# Altium schematic sheet Motion_sensor.SchDoc: Motion Sensor
size A4; Date: 9/24/2014; Author: P.A.; CompanyName: STMicroelectronics; Address1: 12, Rue Jules HOROWITZ; Address2: 38019 Grenoble; Address3: FRANCE; DocumentNumber: MB1189; Revision: A-01; SheetNumber: 13; SheetTotal: 13; Project: STM32F469I-DISCO
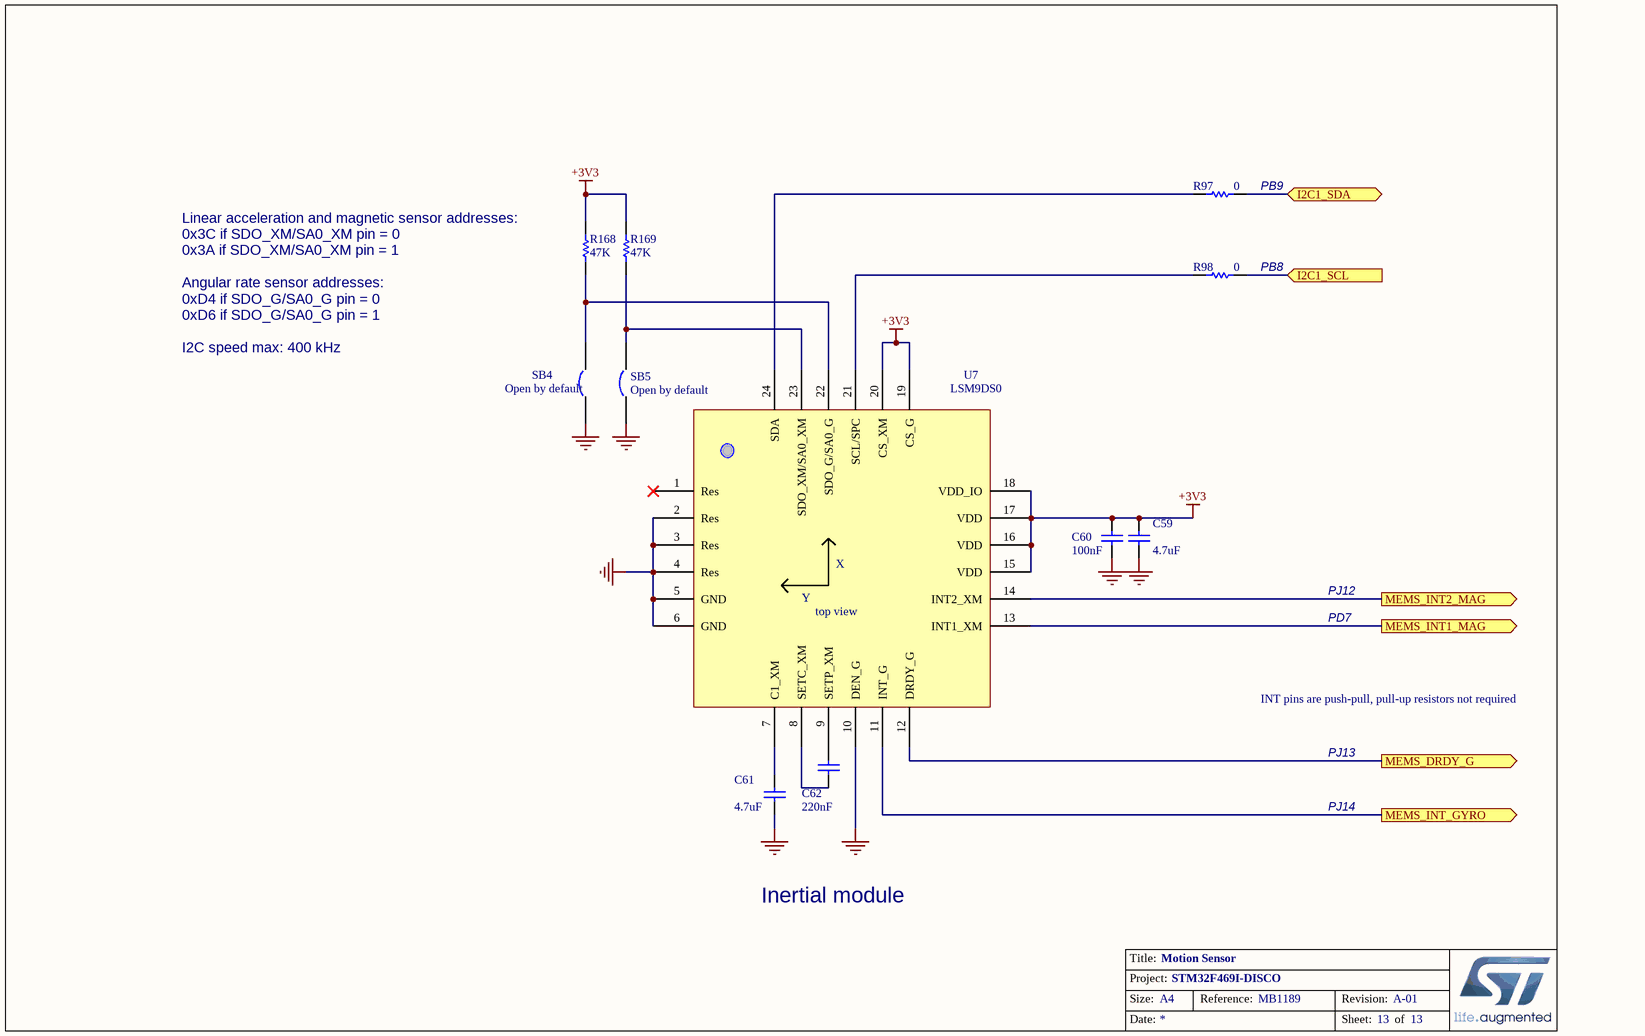
[diagram p0: Motion_sensor.SchDoc]

## Parts
C59  4.7uF  [0603C]
C60  100nF  [0402C]
C61  4.7uF  [0603C]
C62  220nF  [0603C]
R97  0  [0603R]
R98  0  [0603R]
R168  47K  [0603R]
R169  47K  [0603R]
SB4  Open by default  [SB_0603]
SB5  Open by default  [SB_0603]
U7  LSM9DS0  [LGA-24]

## Ports
I2C1_SCL (in), I2C1_SDA (bidir), MEMS_DRDY_G (out), MEMS_INT1_MAG (out), MEMS_INT2_MAG (out), MEMS_INT_GYRO (out)

## Nets
+3V3: C59.1 C60.1 R168.1 R169.1 U7.15(VDD) U7.16(VDD) U7.17(VDD) U7.18(VDD_IO) U7.19(CS_G) U7.20(CS_XM)
GND: C59.2 C60.2 C61.2 SB4.1 SB5.1 U7.2(Res) U7.3(Res) U7.4(Res) U7.5(GND) U7.6(GND) U7.10(DEN_G)
I2C1_SCL: R98.1 ; port I2C1_SCL
I2C1_SDA: R97.1 ; port I2C1_SDA
MEMS_DRDY_G: U7.12(DRDY_G) ; port MEMS_DRDY_G
MEMS_INT1_MAG: U7.13(INT1_XM) ; port MEMS_INT1_MAG
MEMS_INT2_MAG: U7.14(INT2_XM) ; port MEMS_INT2_MAG
MEMS_INT_GYRO: U7.11(INT_G) ; port MEMS_INT_GYRO
NetC61_1: C61.1 U7.7(C1_XM)
NetC62_1: C62.1 U7.9(SETP_XM)
NetC62_2: C62.2 U7.8(SETC_XM)
NetR97_2: R97.2 U7.24(SDA)
NetR98_2: R98.2 U7.21(SCL/SPC)
NetR168_2: R168.2 SB4.2 U7.22(SDO_G/SA0_G)
NetR169_2: R169.2 SB5.2 U7.23(SDO_XM/SA0_XM)

Not connected (* = marked no-connect by the designer): U7 1(Res)*

## Notes on the sheet
- (near R97) PB9
- (near R98) PB8
- Linear acceleration and magnetic sensor addresses:
  0x3C if SDO_XM/SA0_XM pin = 0
  0x3A if SDO_XM/SA0_XM pin = 1
  Angular rate sensor addresses:
  0xD4 if SDO_G/SA0_G pin = 0
  0xD6 if SDO_G/SA0_G pin = 1
  I2C speed max: 400 kHz
- PD7
- PJ12
- INT pins are push-pull, pull-up resistors not required
- PJ13
- PJ14
- Inertial module
- Title:
- Project:
- Size:
- Date:
- A4
- Reference:
- Sheet:
- Revision:
- of
- (in symbol LSM9DS0) X; Y; top view

## Library data of the parts
C59 C61 = Cap: Capacitor; Value: 10nF; Ordered by: Subcon; Published: 8-Jun-2000; Revision: July-2002: Re-released for DXP Platform.; Publisher: Altium Limited
C60 C62 = CAP: Capacitor; Value: 100pF; Ordered by: Subcon; Published: 8-Jun-2000; Revision: July-2002: Re-released for DXP Platform.; Publisher: Altium Limited
R97 R98 = Res1: Resistor; Value: 1K; Ordered by: Subcon; Published: 8-Jun-2000; Revision: July-2002: Re-released for DXP Platform.; Publisher: Altium Limited
R168 R169 = res1: Resistor; Value: 1K; Ordered by: Subcon; Published: 8-Jun-2000; Revision: July-2002: Re-released for DXP Platform.; Publisher: Altium Limited
SB4 SB5 = Circuit Breaker: Ordered by: Subcon; Comments: Solder bridge; Fitted: NO; Published: 24-Mar-1999; Revision: July-2002: Re-released for DXP Platform.; Publisher: Altium Limited
U7 = LSM9DS0: inertial module; Ordered by: STM